# Altium schematic sheet eHorglass.SchDoc
size A3; SheetNumber: 1; SheetTotal: 1
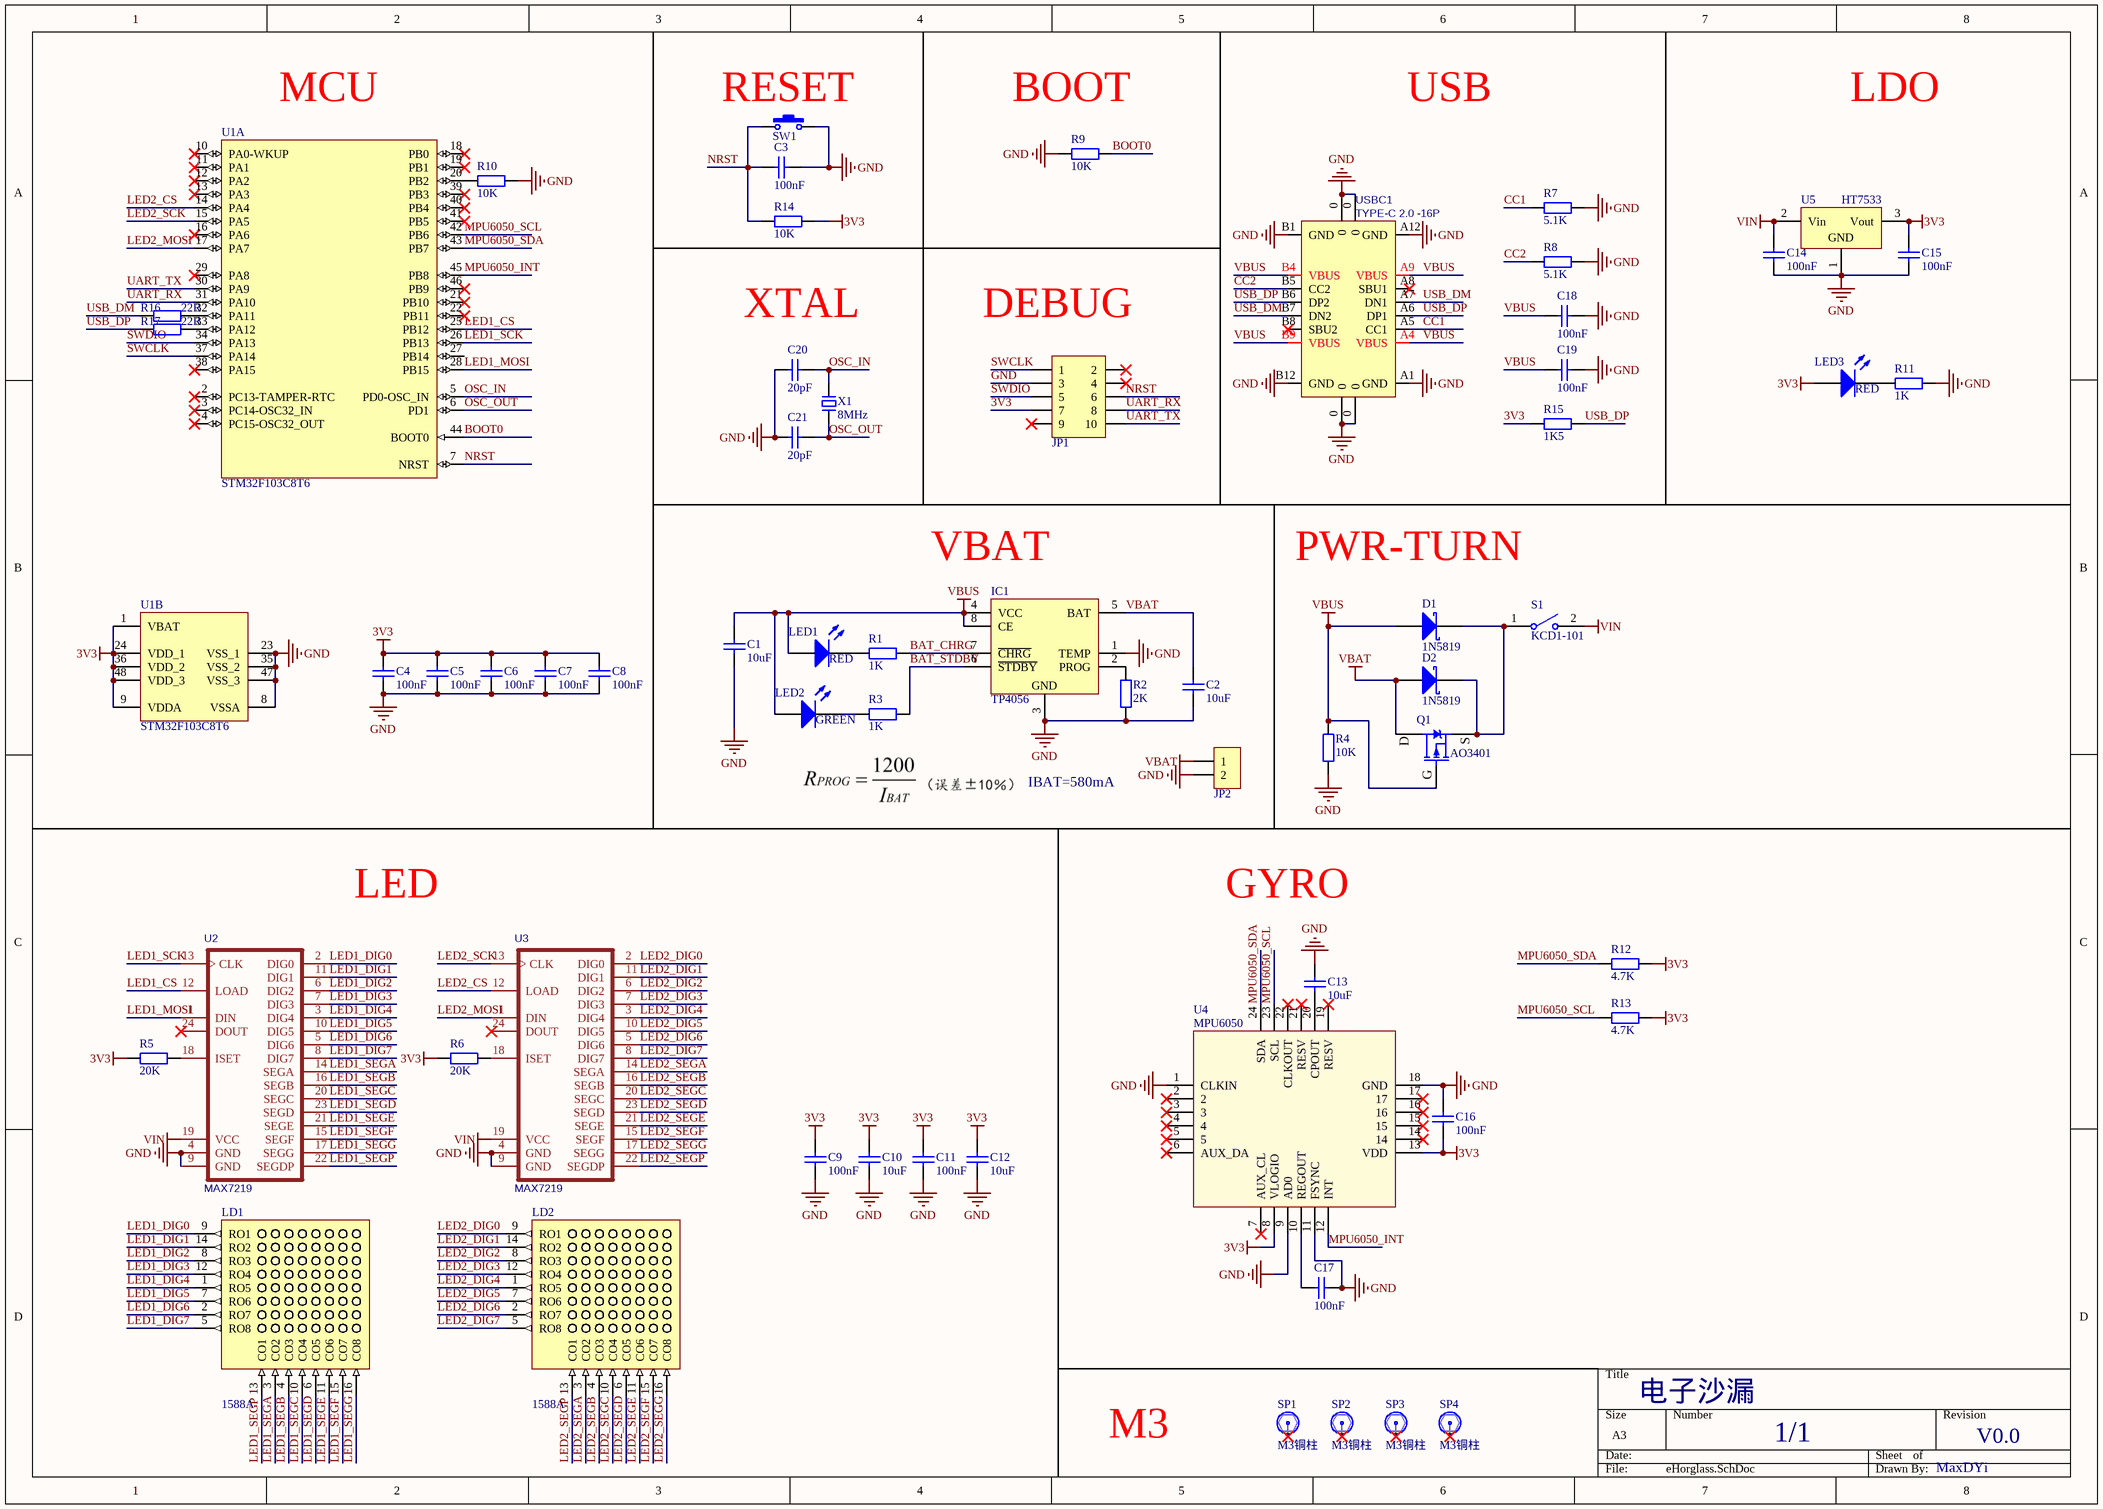
[diagram p0: eHorglass.SchDoc]

## Parts
C1  10uF  [C0603_M]
C2  10uF  [C0603_M]
C3  100nF  [C0603_M]
C4  100nF  [C0603_M]
C5  100nF  [C0603_M]
C6  100nF  [C0603_M]
C7  100nF  [C0603_M]
C8  100nF  [C0603_M]
C9  100nF  [C0603_M]
C10  10uF  [C0603_M]
C11  100nF  [C0603_M]
C12  10uF  [C0603_M]
C13  10uF  [C0603_M]
C14  100nF  [C0603_M]
C15  100nF  [C0603_M]
C16  100nF  [C0603_M]
C17  100nF  [C0603_M]
C18  100nF  [C0603_M]
C19  100nF  [C0603_M]
C20  20pF  [C0603_M]
C21  20pF  [C0603_M]
D1  1N5819  [SOD-323]
D2  1N5819  [SOD-323]
IC1  TP4056  [SOIC-8_EP]
JP1  Header 5X2  [HDR2.54-LI-2x5P]  (value not drawn)
JP2  HDR-1X2  [XH2.54-LI-2P]  (value not drawn)
LD1  1588A  [LED 8*8-32-FH]
LD2  1588A  [LED 8*8-32-FH]
LED1  RED  [LED0603_R]
LED2  GREEN  [LED0603_G]
LED3  RED  [LED0603_R]
Q1  AO3401  [SOT23-3N]
R1  1K  [R0603_M]
R2  2K  [R0603_M]
R3  1K  [R0603_M]
R4  10K  [R0603_M]
R5  20K  [R0603_M]
R6  20K  [R0603_M]
R7  5.1K  [R0603_M]
R8  5.1K  [R0603_M]
R9  10K  [R0603_M]
R10  10K  [R0603_M]
R11  1K  [R0603_M]
R12  4.7K  [R0603_M]
R13  4.7K  [R0603_M]
R14  10K  [R0603_M]
R15  1K5  [R0603_M]
R16  22R  [R0603_M]
R17  22R  [R0603_M]
S1  KCD1-101  [HDR2.54-LI-2P]
SP1  M3铜柱  [M3x20+6_N]
SP2  M3铜柱  [M3x20+6_N]
SP3  M3铜柱  [M3x20+6_N]
SP4  M3铜柱  [M3x20+6_N]
SW1  3x6x5  [SW SMD-3*6*2.5]  (value not drawn)
U1  STM32F103C8T6  [LQFP48_N]  (parts A,B of 2)
U2  MAX7219  [SOIC-24W]
U3  MAX7219  [SOIC-24W]
U4  MPU6050  [QFN24-P50]
U5  HT7533  [SOT89_N]
USBC1  TYPE-C 2.0 -16P  [USB-C-SMD_16P]
X1  8MHz  [OSC-5032-2P]

## Nets
3V3: C4.2 C5.2 C6.2 C7.2 C8.2 C9.2 C10.2 C11.2 C12.2 C15.2 C16.2 JP1.7 LED3.1(A) R5.2 R6.2 R12.1 R13.1 R14.2 R15.1 U1.1(VBAT) U1.9(VDDA) U1.24(VDD_1) U1.36(VDD_2) U1.48(VDD_3) U4.8(VLOGIO) U4.13(VDD) U5.3(Vout)
GND: C1.1 C2.1 C3.1 C4.1 C5.1 C6.1 C7.1 C8.1 C9.1 C10.1 C11.1 C12.1 C13.1 C14.1 C15.1 C16.1 C17.1 C18.2 C19.2 C20.1 C21.2 IC1.1(TEMP) IC1.3(GND) JP1.3 JP2.2 R2.1 R4.1 R7.1 R8.1 R9.1 R10.1 R11.1 SW1.2 U1.8(VSSA) U1.23(VSS_1) U1.35(VSS_2) U1.47(VSS_3) U2.4(GND) U2.9(GND) U3.4(GND) U3.9(GND) U4.1(CLKIN) U4.9(AD0) U4.11(FSYNC) U4.18(GND) U5.1(GND) USBC1.0 USBC1.A1(GND) USBC1.A12(GND) USBC1.B1(GND) USBC1.B12(GND)
VBAT: C2.2 D2.1(A) IC1.5(BAT) JP2.1 Q1.3(D)
VBUS: C1.2 C18.1 C19.1 D1.1(A) IC1.4(VCC) IC1.8(CE) LED1.1(A) LED2.1(A) Q1.1(G) R4.2 USBC1.A4(VBUS) USBC1.A9(VBUS) USBC1.B4(VBUS) USBC1.B9(VBUS)
VIN: C14.2 S1.2 U2.19(VCC) U3.19(VCC) U5.2(Vin)
BAT_CHRG: IC1.7(~{CHRG}) R1.1
BAT_STDBY: IC1.6(~{STDBY}) R3.1
BOOT0: R9.2 U1.44(BOOT0)
CC1: R7.2 USBC1.A5(CC1)
CC2: R8.2 USBC1.B5(CC2)
LED1_CS: U1.25(PB12) U2.12(LOAD)
LED1_DIG0: LD1.9(RO1) U2.2(DIG0)
LED1_DIG1: LD1.14(RO2) U2.11(DIG1)
LED1_DIG2: LD1.8(RO3) U2.6(DIG2)
LED1_DIG3: LD1.12(RO4) U2.7(DIG3)
LED1_DIG4: LD1.1(RO5) U2.3(DIG4)
LED1_DIG5: LD1.7(RO6) U2.10(DIG5)
LED1_DIG6: LD1.2(RO7) U2.5(DIG6)
LED1_DIG7: LD1.5(RO8) U2.8(DIG7)
LED1_MOSI: U1.28(PB15) U2.1(DIN)
LED1_SCK: U1.26(PB13) U2.13(CLK)
LED1_SEGA: LD1.3(CO2) U2.14(SEGA)
LED1_SEGB: LD1.4(CO3) U2.16(SEGB)
LED1_SEGC: LD1.10(CO4) U2.20(SEGC)
LED1_SEGD: LD1.6(CO5) U2.23(SEGD)
LED1_SEGE: LD1.11(CO6) U2.21(SEGE)
LED1_SEGF: LD1.15(CO7) U2.15(SEGF)
LED1_SEGG: LD1.16(CO8) U2.17(SEGG)
LED1_SEGP: LD1.13(CO1) U2.22(SEGDP)
LED2_CS: U1.14(PA4) U3.12(LOAD)
LED2_DIG0: LD2.9(RO1) U3.2(DIG0)
LED2_DIG1: LD2.14(RO2) U3.11(DIG1)
LED2_DIG2: LD2.8(RO3) U3.6(DIG2)
LED2_DIG3: LD2.12(RO4) U3.7(DIG3)
LED2_DIG4: LD2.1(RO5) U3.3(DIG4)
LED2_DIG5: LD2.7(RO6) U3.10(DIG5)
LED2_DIG6: LD2.2(RO7) U3.5(DIG6)
LED2_DIG7: LD2.5(RO8) U3.8(DIG7)
LED2_MOSI: U1.17(PA7) U3.1(DIN)
LED2_SCK: U1.15(PA5) U3.13(CLK)
LED2_SEGA: LD2.3(CO2) U3.14(SEGA)
LED2_SEGB: LD2.4(CO3) U3.16(SEGB)
LED2_SEGC: LD2.10(CO4) U3.20(SEGC)
LED2_SEGD: LD2.6(CO5) U3.23(SEGD)
LED2_SEGE: LD2.11(CO6) U3.21(SEGE)
LED2_SEGF: LD2.15(CO7) U3.15(SEGF)
LED2_SEGG: LD2.16(CO8) U3.17(SEGG)
LED2_SEGP: LD2.13(CO1) U3.22(SEGDP)
MPU6050_INT: U1.45(PB8) U4.12(INT)
MPU6050_SCL: R13.2 U1.42(PB6) U4.23(SCL)
MPU6050_SDA: R12.2 U1.43(PB7) U4.24(SDA)
NRST: C3.2 JP1.6 R14.1 SW1.1 U1.7(NRST)
OSC_IN: C20.2 U1.5(PD0-OSC_IN) X1.2
OSC_OUT: C21.1 U1.6(PD1) X1.1
SWCLK: JP1.1 U1.37(PA14)
SWDIO: JP1.5 U1.34(PA13)
UART_RX: JP1.8 U1.31(PA10)
UART_TX: JP1.10 U1.30(PA9)
USB_DM: R16.1 USBC1.A7(DN1) USBC1.B7(DN2)
USB_DP: R15.2 R17.1 USBC1.A6(DP1) USBC1.B6(DP2)
NetC13_2: C13.2 U4.20(CPOUT)
NetC17_2: C17.2 U4.10(REGOUT)
NetD1_2: D1.2(K) D2.2(K) Q1.2(S) S1.1
NetIC1_2: IC1.2(PROG) R2.2
NetLED1_2: LED1.2(K) R1.2
NetLED2_2: LED2.2(K) R3.2
NetLED3_2: LED3.2(K) R11.2
NetR5_1: R5.1 U2.18(ISET)
NetR6_1: R6.1 U3.18(ISET)
NetR10_2: R10.2 U1.20(PB2)
NetR16_2: R16.2 U1.32(PA11)
NetR17_2: R17.2 U1.33(PA12)

Not connected (* = marked no-connect by the designer): JP1 2* 4* 9*; SP1 1*; SP2 1*; SP3 1*; SP4 1*; U1 2(PC13-TAMPER-RTC)* 3(PC14-OSC32_IN)* 4(PC15-OSC32_OUT)* 10(PA0-WKUP)* 11(PA1)* 12(PA2)* 13(PA3)* 16(PA6)* 18(PB0)* 19(PB1)* 21(PB10)* 22(PB11)* 27(PB14) 29(PA8)* 38(PA15)* 39(PB3)* 40(PB4)* 41(PB5)* 46(PB9)*; U2 24(DOUT)*; U3 24(DOUT)*; U4 2* 3* 4* 5* 6(AUX_DA)* 7(AUX_CL)* 14* 15* 16* 17* 19(RESV)* 21(RESV)* 22(CLKOUT)*; USBC1 A8(SBU1)* B8(SBU2)*

## Notes on the sheet
- (near U1) MCU
- (near SW1) RESET
- (near R9) BOOT
- USB
- LDO
- XTAL
- (near JP1) DEBUG
- (near IC1) VBAT
- PWR-TURN
- IBAT=580mA
- LED
- GYRO
- M3
- 电子沙漏
- 1/1
- V0.0
- MaxDYi

## Library data of the parts
C1-C21 = C: 贴片电容/MLCC电容; BOM名称: 无极性贴片电容; 联系下单店铺卖家 免费帮你查找封装: 联系下单店铺卖家 免费技术支持
D1 D2 = 1N5819: 肖特基二极管; 当前库版本V2022.12.25 @淘宝卖家:黄晶宝石: 最新版本发布https://shop463601444.taobao.com; BOM名称: 肖特基二极管
IC1 = TP4056: 锂电池充电管理; 当前库版本V2022.10.7 @淘宝卖家:黄晶宝石: 最新版本发布https://shop463601444.taobao.com; BOM名称: 锂电池充电管理
JP1 = Header 5X2: 5*2P接插件; 联系卖家，免费查找封装: 唯一出售店铺网址https://shop463601444.taobao.com; 封装库来自淘宝卖家ID：黄晶宝石: 其他店铺购入均为盗版封装库，请立即申请退款，本店现金奖励50~200元; BOM名称: 5*2P接插件
JP2 = Header 2: 2P接插件; 联系卖家，免费查找封装: 唯一出售店铺网址https://shop463601444.taobao.com; 封装库来自淘宝卖家ID：黄晶宝石: 其他店铺购入均为盗版封装库，请立即申请退款，本店现金奖励50~200元; BOM名称: 2P接插件
LD1 LD2 = 1588A: 共阴单色LED8*8点阵屏; 联系卖家 免费技术支持: 唯一出售店铺网址https://shop463601444.taobao.com; BOM名称: 共阴单色LED8*8点阵屏
LED1-LED3 = LED: 贴片LED; 封装库来自淘宝卖家：黄晶宝石: 其他店铺购入均为盗版封装库，无更新权益，退款现金奖励200~1000元; BOM名称: 贴片LED
Q1 = AO3401: P沟道 30V/4.2A; BOM名称: 场效应管; 联系下单店铺卖家 免费帮你查找封装: 联系下单店铺卖家 免费技术支持; 参数: P沟道 30V/4.2A
R1-R4 R7-R11 R14 = R: 贴片电阻; 当前库版本V2022.10.7 @黄晶宝石: 最新版本发布https://shop463601444.taobao.com; BOM名称: 贴片电阻
R5 R6 R12 R13 R15-R17 = R: 贴片电阻; 联系下单店铺卖家 免费帮你查找封装: 联系下单店铺卖家 免费技术支持; BOM名称: 贴片电阻
S1 = KCD1-101: 1路单刀船型开关; 联系下单店铺卖家 免费技术支持: 联系下单店铺卖家 免费帮你查找封装; BOM名称: 1路单刀船型开关
SP1-SP4 = 铜柱加头大焊盘: 铜柱; 联系下单店铺卖家 免费技术支持: 联系下单店铺卖家 免费帮你查找封装; BOM名称: 铜柱
SW1 = SW 3x6: 3x6轻触开关; 联系下单店铺卖家 免费技术支持: 联系下单店铺卖家 免费帮你查找封装; BOM名称: 3x6轻触开关
U1 = STM32F103C8T6: STM32 ARM-based 32-bit MCU Performance Line with 64 kB Flash, 20 kB Internal RAM, -40 to +85癈 Temperature, 48-Pin LQFP, Tray; 封装库来自淘宝卖家：黄晶宝石: 最新版本发布https://shop463601444.taobao.com; DatasheetVersion: rev13.0, Apr-2011; PackageVersion: rev13, Apr-2011; PackageReference: LQFP48; PackageDescription: 48-Pin Low-Profile Quad Flat Pack, 7 x 7 mm Body, 0.5 mm Pitch (LQFP48); ComponentLink1Description: Manufacturer URL; ComponentLink1URL: http://www.st.com/; ComponentLink2Description: STM32F103 Datasheet; ComponentLink2URL: http://www.st.com/internet/com/TECHNICAL_RESOURCES/TECHNICAL_LITERATURE/DATASHEET/CD00161566.pdf; ComponentLink3Description: STM32 Family Web Page; ComponentLink3URL: www.st.com/stm32
U2 U3 = MAX7219: 8位 LED驱动器; 封装库来自淘宝卖家：黄晶宝石: 其他店铺购入均为盗版封装库，无更新权益，退款现金奖励200~1000元; 当前库版本V2022.12.25 @淘宝卖家:黄晶宝石: 最新版本发布https://shop463601444.taobao.com
U4 = MPU6050: 三轴加速度+三轴陀螺仪; 封装库来自淘宝卖家：黄晶宝石: 其他店铺购入均为盗版封装库，请立即申请退款，本店现金奖励100~500元
U5 = HT7533: LDO线性稳压芯片; 当前库版本V2022.12.25 @淘宝卖家:黄晶宝石: 最新版本发布https://shop463601444.taobao.com; BOM名称: HT7533
USBC1 = USB2.0_Type-C_16Pin: USB2.0_Type-C_16Pin母座; 当前库版本V2022.12.25 @淘宝卖家:黄晶宝石: 最新版本发布https://shop463601444.taobao.com
X1 = XTAL-2P: 2脚无源晶振(谐振器）; 联系下单店铺卖家 免费帮你查找封装: 联系下单店铺卖家 免费技术支持; BOM名称: 2脚无源晶振(谐振器）